# EAGLE design ATmega8_panorama-photo_v1 (EAGLE 5.10)
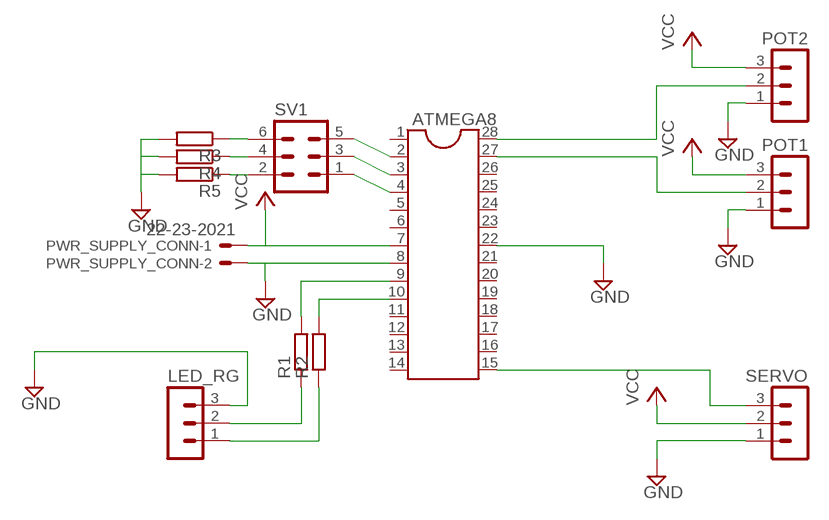
[diagram p0: schematic, sheet 1]

## Parts
ATMEGA8  DIL28-3  [DIL28-3]
LED_RG  MA03-1  [MA03-1]
POT1  MA03-1  [MA03-1]
POT2  MA03-1  [MA03-1]
PWR_SUPPLY_CONN  22-23-2021  [22-23-2021]
R1  R-EU_0204/7  [0204/7]
R2  R-EU_0204/7  [0204/7]
R3  R-EU_0204/7  [0204/7]
R4  R-EU_0204/7  [0204/7]
R5  R-EU_0204/7  [0204/7]
SERVO  MA03-1  [MA03-1]
SV1  MA03-2  [MA03-2]

## Nets
BTN_INPUT1: ATMEGA8.2 SV1.5
BTN_INPUT2: ATMEGA8.3 SV1.3
BTN_INPUT3: ATMEGA8.4 SV1.1
BTN_PULLDOWN1: R3.1 SV1.6
BTN_PULLDOWN2: R4.1 SV1.4
BTN_PULLDOWN3: R5.1 SV1.2
GND: ATMEGA8.8 ATMEGA8.22 LED_RG.3 POT1.1 POT2.1 PWR_SUPPLY_CONN.2 R3.2 R4.2 R5.2 SERVO.1
LED1_COLOR1: LED_RG.1 R2.1
LED1_COLOR2: ATMEGA8.9 R1.2
N$2: ATMEGA8.10 R2.2
N$4: LED_RG.2 R1.1
POT1_ADC: ATMEGA8.27 POT1.2
POT2_ADC: ATMEGA8.28 POT2.2
SERVO1_PWM: ATMEGA8.15 SERVO.3
VCC: ATMEGA8.7 POT1.3 POT2.3 PWR_SUPPLY_CONN.1 SERVO.2
Unconnected: ATMEGA8.1 ATMEGA8.5 ATMEGA8.6 ATMEGA8.11 ATMEGA8.12 ATMEGA8.13 ATMEGA8.14 ATMEGA8.16 ATMEGA8.17 ATMEGA8.18 ATMEGA8.19 ATMEGA8.20 ATMEGA8.21 ATMEGA8.23 ATMEGA8.24 ATMEGA8.25 ATMEGA8.26

## Library data of the parts
ATMEGA8 = ic-package:DIL28: Dual In Line
LED_RG POT1 POT2 SERVO = con-lstb:MA03-1: PIN HEADER
PWR_SUPPLY_CONN = con-molex:22-23-2021: .100" (2.54mm) Center Header - 2 Pin
R1-R5 = resistor:R-EU_: RESISTOR, European symbol
SV1 = con-lstb:MA03-2: PIN HEADER

## Board
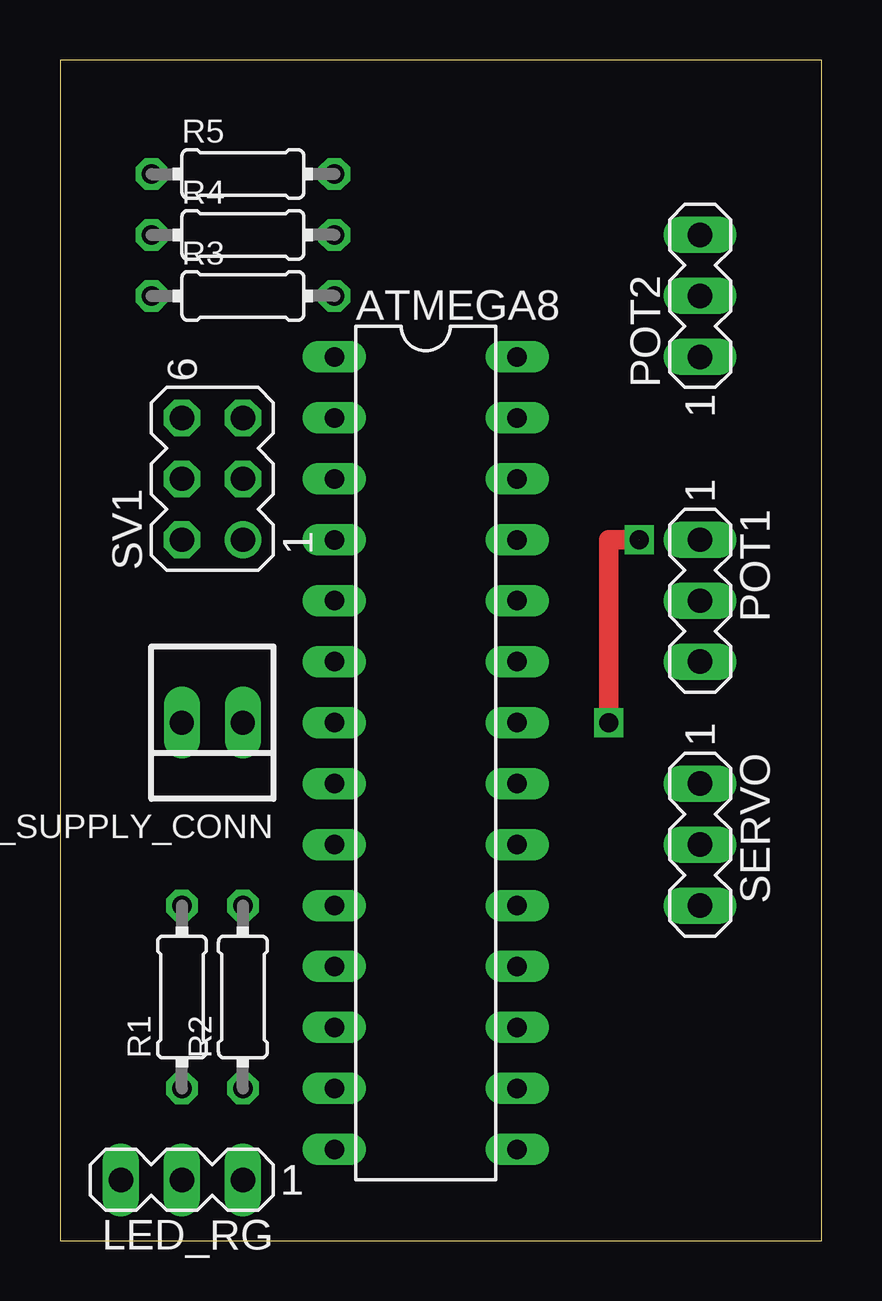
[diagram p1: board, top side]
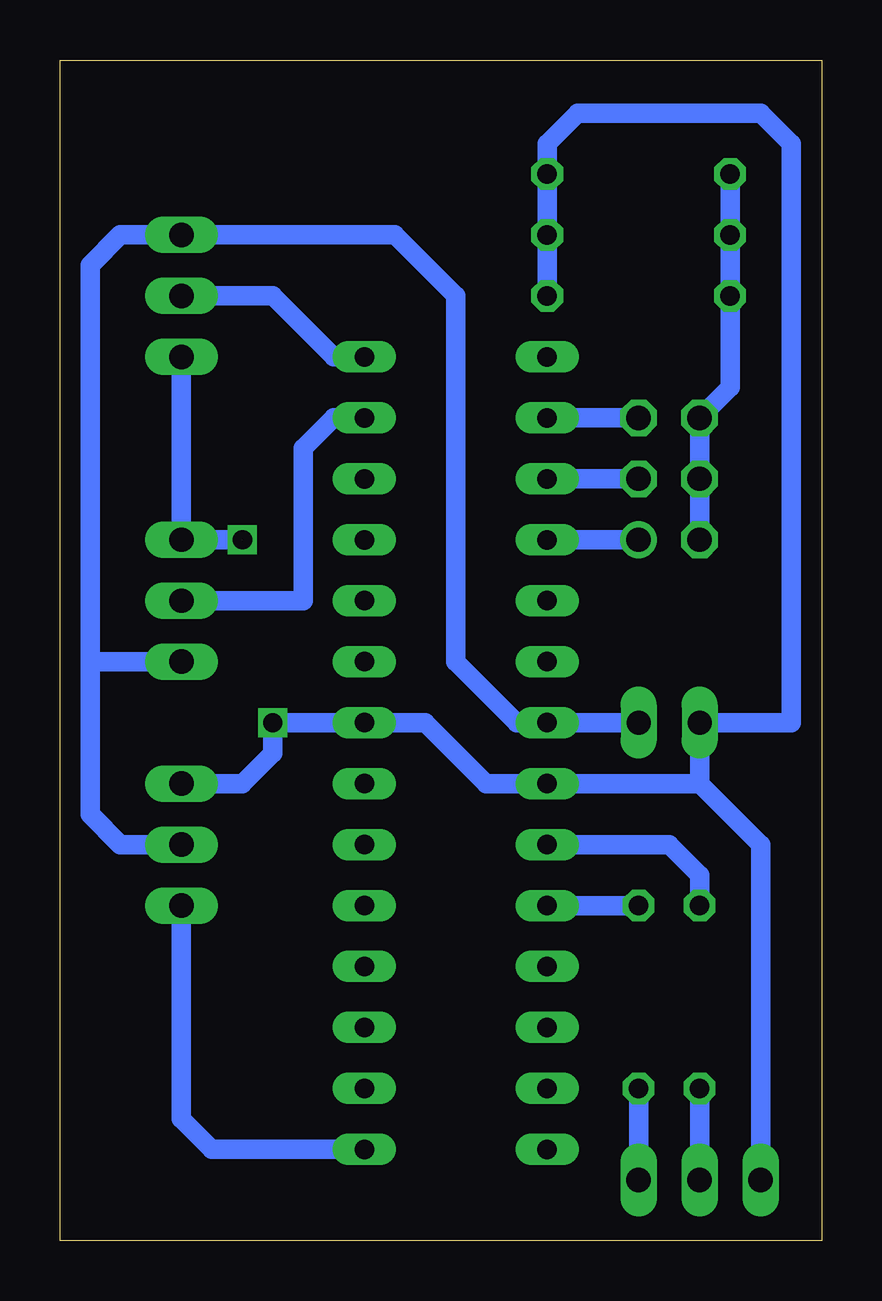
[diagram p2: board, bottom side, seen from below]

Size 31.73 x 49.2 mm. Coordinates in mm from the lower left corner, seen from the top.
Outline: 0,0 31.73,0 31.73,49.2 0,49.2 0,0
Copper layers (1*16): Top 0.035mm / dielectric 1.5mm / Bottom 0.035mm
Design rules "default": minimum track width 10mil, minimum drill 24mil, track to track 8mil, track to pad 8mil, pad to pad 8mil, via to via 8mil, smd to smd 8mil, copper to edge 40mil, drill to drill 8mil, minimum pad ring 10mil, minimum via ring 8mil, stop-mask expansion 4mil, vias tented up to drill 0mil, thermal gap 10mil

### Footprints (pad centres in the part's own frame; a part is rotated, then mirrored left to right if it is on the bottom)
DIL28-3 = drill 0.813 long: 1 -16.51,-3.81; 2 -13.97,-3.81; 3 -11.43,-3.81; 4 -8.89,-3.81; 5 -6.35,-3.81; 6 -3.81,-3.81; 7 -1.27,-3.81; 8 1.27,-3.81; 9 3.81,-3.81; 10 6.35,-3.81; 11 8.89,-3.81; 12 11.43,-3.81; 13 13.97,-3.81; 14 16.51,-3.81; 15 16.51,3.81; 16 13.97,3.81; 17 11.43,3.81; 18 8.89,3.81; 19 6.35,3.81; 20 3.81,3.81; 21 1.27,3.81; 22 -1.27,3.81; 23 -3.81,3.81; 24 -6.35,3.81; 25 -8.89,3.81; 26 -11.43,3.81; 27 -13.97,3.81; 28 -16.51,3.81
MA03-1 = drill 1.016 long: 1 -2.54,0; 2 0,0; 3 2.54,0
22-23-2021 = drill 1 long: 1 -1.27,0; 2 1.27,0
0204/7 = drill 0.813 octagon: 1 -3.81,0; 2 3.81,0
MA03-2 = drill 1.016 round: 1 -2.54,-1.27 | drill 1.016 octagon: 2 -2.54,1.27; 3 0,-1.27; 4 0,1.27; 5 2.54,-1.27; 6 2.54,1.27

### Placement (x,y rotation side)
ATMEGA8  15.24,20.32 270 top
LED_RG  5.08,2.54 180 top
POT1  26.67,26.67 270 top
POT2  26.67,39.37 90 top
PWR_SUPPLY_CONN  6.35,21.59 180 top
R1  5.08,10.16 90 top
R2  7.62,10.16 90 top
R3  7.62,39.37 0 top
R4  7.62,41.91 0 top
R5  7.62,44.45 0 top
SERVO  26.67,16.51 270 top
SV1  6.35,31.75 90 top

### Tracks (layer width: path | path; a pad name or v marks a point on that pad's centre or on a via)
BTN_INPUT1
  Bottom 0.813: SV1.5 ATMEGA8.2
BTN_INPUT2
  Bottom 0.813: SV1.3 ATMEGA8.3
BTN_INPUT3
  Bottom 0.813: SV1.1 ATMEGA8.4
BTN_PULLDOWN1
  Bottom 0.813: SV1.6 3.81,35.56 R3.1
BTN_PULLDOWN2
  Bottom 0.813: R4.1 3.81,35.56 5.08,34.29 SV1.4
BTN_PULLDOWN3
  Bottom 0.813: SV1.2 5.08,34.29 3.81,35.56 R5.1
GND  (via drill 0.8)  (1 unrouted)
  Top 0.813: v22.86,21.59 22.86,29.21 24.13,29.21
  Bottom 0.813: 5.08,19.05 ATMEGA8.8 13.97,19.05 16.51,21.59 ATMEGA8.22 v22.86,21.59 22.86,20.32 24.13,19.05 SERVO.1 | POT2.1 POT1.1 24.13,29.21 | LED_RG.3 2.54,16.51 5.08,19.05 | 5.08,19.05 PWR_SUPPLY_CONN.2 1.27,21.59 1.27,45.72 2.54,46.99 10.16,46.99 11.43,45.72 R5.2 R4.2 R3.2
  other vias: 5.08,21.59
LED1_COLOR1
  Bottom 0.813: R2.1 LED_RG.1
LED1_COLOR2
  Bottom 0.813: R1.2 5.08,15.24 6.35,16.51 ATMEGA8.9
N$1  (via drill 0.8)
  other vias: 24.13,29.21
N$2
  Bottom 0.813: R2.2 ATMEGA8.10
N$4
  Bottom 0.813: LED_RG.2 R1.1
POT1_ADC
  Bottom 0.813: ATMEGA8.27 20.32,34.29 21.59,33.02 21.59,26.67 POT1.2
POT2_ADC
  Bottom 0.813: ATMEGA8.28 20.32,36.83 22.86,39.37 POT2.2
SERVO1_PWM
  Bottom 0.813: SERVO.3 26.67,5.08 25.4,3.81 ATMEGA8.15
VCC  (via drill 0.8)
  Bottom 0.813: PWR_SUPPLY_CONN.1 ATMEGA8.7 12.7,21.59 15.24,24.13 15.24,39.37 17.78,41.91 POT2.3 29.21,41.91 30.48,40.64 30.48,24.13 | 30.48,24.13 POT1.3 | SERVO.2 29.21,16.51 30.48,17.78 30.48,24.13
  other vias: 7.62,21.59